# Altium schematic sheet 02.LemonAutopilot_2.SchDoc
size A4
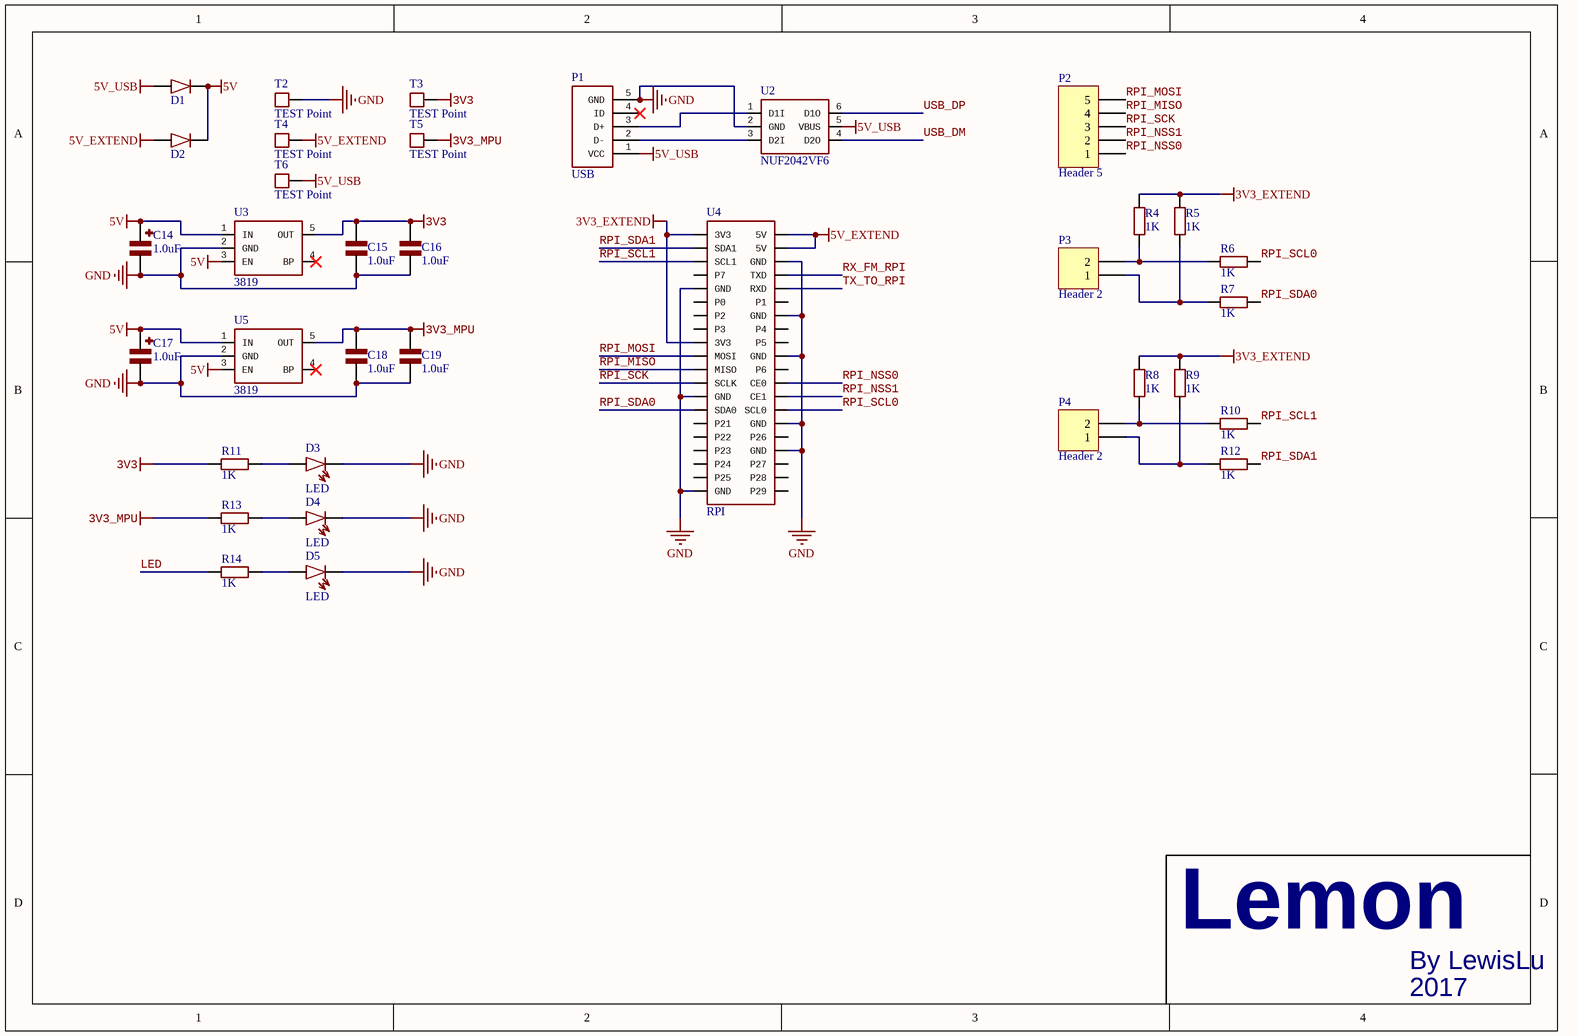
[diagram p0: 02.LemonAutopilot_2.SchDoc]

## Parts
C14  1.0uF  [3216_C]
C15  1.0uF  [0603_C]
C16  1.0uF  [0603_C]
C17  1.0uF  [3216_C]
C18  1.0uF  [0603_C]
C19  1.0uF  [0603_C]
D1  D  [SOD-323]  (value not drawn)
D2  D  [SOD-323]  (value not drawn)
D3  LED  [0603_D]
D4  LED  [0603_D]
D5  LED  [0603_D]
P1  USB  [MICROUSB]
P2  Header 5  [HDR1X5]
P3  Header 2  [HDR1X2]
P4  Header 2  [HDR1X2]
R4  1K  [0603_R]
R5  1K  [0603_R]
R6  1K  [0603_R]
R7  1K  [0603_R]
R8  1K  [0603_R]
R9  1K  [0603_R]
R10  1K  [0603_R]
R11  1K  [0603_R]
R12  1K  [0603_R]
R13  1K  [0603_R]
R14  1K  [0603_R]
T2  TEST Point  [TEST]
T3  TEST Point  [TEST]
T4  TEST Point  [TEST]
T5  TEST Point  [TEST]
T6  TEST Point  [TEST]
U2  NUF2042VF6
U3  3819  [SOT23-5]
U4  RPI
U5  3819  [SOT23-5]

## Nets
3V3: C15.2 C16.2 R11.1 T3.0(TEST) U3.5(OUT)
3V3_EXTEND: R4.1 R5.1 R8.1 R9.1 U4.1(3V3) U4.17(3V3)
3V3_MPU: C18.2 C19.2 R13.1 T5.0(TEST) U5.5(OUT)
5V: C14.1 C17.1 D1.2 D2.2 U3.1(IN) U3.3(EN) U5.1(IN) U5.3(EN)
5V_EXTEND: D2.1 T4.0(TEST) U4.2(5V) U4.4(5V)
5V_USB: D1.1 P1.1(VCC) T6.0(TEST) U2.5(VBUS)
GND: C14.2 C15.1 C16.1 C17.2 C18.1 C19.1 D3.2 D4.2 D5.2 P1.5(GND) T2.0(TEST) U2.2(GND) U3.2(GND) U4.6(GND) U4.9(GND) U4.14(GND) U4.20(GND) U4.25(GND) U4.30(GND) U4.34(GND) U4.39(GND) U5.2(GND)
LED: R14.1
RPI_MISO: P2.4 U4.21(MISO)
RPI_MOSI: P2.5 U4.19(MOSI)
RPI_NSS0: P2.1 U4.24(CE0)
RPI_NSS1: P2.2 U4.26(CE1)
RPI_SCK: P2.3 U4.23(SCLK)
RPI_SCL0: R6.2 U4.28(SCL0)
RPI_SCL1: R10.2 U4.5(SCL1)
RPI_SDA0: R7.2 U4.27(SDA0)
RPI_SDA1: R12.2 U4.3(SDA1)
RX_FM_RPI: U4.8(TXD)
TX_TO_RPI: U4.10(RXD)
USB_DM: U2.4(D2O)
USB_DP: U2.6(D1O)
NetD3_1: D3.1 R11.2
NetD4_1: D4.1 R13.2
NetD5_1: D5.1 R14.2
NetP1_2: P1.2(D-) U2.3(D2I)
NetP1_3: P1.3(D+) U2.1(D1I)
NetP3_1: P3.1 R5.2 R7.1
NetP3_2: P3.2 R4.2 R6.1
NetP4_1: P4.1 R9.2 R12.1
NetP4_2: P4.2 R8.2 R10.1

Not connected (* = marked no-connect by the designer): P1 4(ID)*; U3 4(BP)*; U4 7(P7) 11(P0) 12(P1) 13(P2) 15(P3) 16(P4) 18(P5) 22(P6) 29(P21) 31(P22) 32(P26) 33(P23) 35(P24) 36(P27) 37(P25) 38(P28) 40(P29); U5 4(BP)*

## Notes on the sheet
- Lemon
- By LewisLu
- 2017

## Library data of the parts
C14 C17 = C3216
C15 C16 C18 C19 = C0603
D1 D2 = D0603
D3-D5 = D0603_LED
P2 = Header 5: Header, 5-Pin; LatestRevisionDate: 17-Jul-2002; LatestRevisionNote: Re-released for DXP Platform.; Publisher: Altium Limited
P3 P4 = Header 2: Header, 2-Pin; LatestRevisionDate: 17-Jul-2002; LatestRevisionNote: Re-released for DXP Platform.; Publisher: Altium Limited
R4-R14 = R0603
T2-T6 = TEST
U2 = NUF2042XV6
U3 U5 = SPX3819
U4 = RPI_EXTEND